# EAGLE schematic spi_lcd_onesided (EAGLE 6.1)
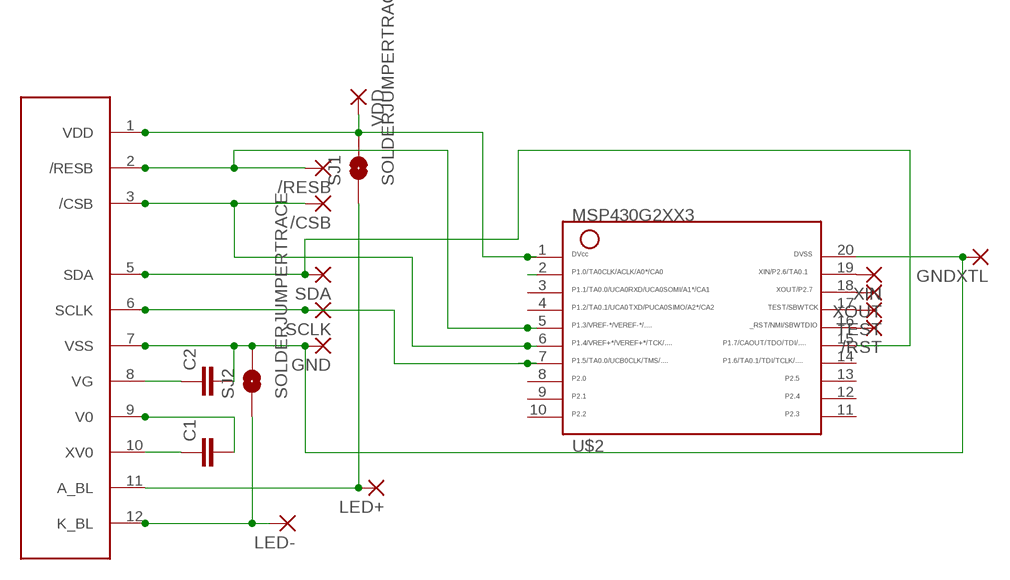
[diagram p0: schematic, sheet 1]

## Parts
/CSB  1,6/0,9  [1,6/0,9]
/RESB  1,6/0,9  [1,6/0,9]
/RST  1,6/0,9  [1,6/0,9]
C1  CAP0805  [0805]
C2  CAP0805  [0805]
GND  1,6/0,9  [1,6/0,9]
GNDXTL  SMD2  [SMD1,27-2,54]
LED+  1,6/0,9  [1,6/0,9]
LED-  1,6/0,9  [1,6/0,9]
SCLK  1,6/0,9  [1,6/0,9]
SDA  1,6/0,9  [1,6/0,9]
SJ1  SOLDERJUMPERTRACE  [SJ_2S-TRACE]
SJ2  SOLDERJUMPERTRACE  [SJ_2S-TRACE]
TEST  1,6/0,9  [1,6/0,9]
U$1  PE9665WRFPE9665WRF-WHOLE  [PE9665WRF]
U$2  G2XX3---PW20  [PW20]
VDD  1,6/0,9  [1,6/0,9]
XIN  SMD2  [SMD1,27-2,54]
XOUT  SMD2  [SMD1,27-2,54]

## Nets
C2: C2.1 U$1.8(VG)
GND: C2.2 GND.1(P) GNDXTL.1(P) SJ2.2 U$1.7(VSS) U$2.20
N$1: C1.1 U$1.10(XV0)
N$2: C1.2 U$1.9(V0)
N$3: U$2.19 XIN.1(P)
N$4: LED+.1(P) SJ1.1 U$1.11(A_BL)
N$5: LED-.1(P) SJ2.1 U$1.12(K_BL)
N$6: U$2.18 XOUT.1(P)
N$7: SCLK.1(P) U$1.6(SCLK) U$2.7
N$8: SDA.1(P) U$1.5(SDA) U$2.15
N$9: /CSB.1(P) U$1.3(/CSB) U$2.6
N$10: /RESB.1(P) U$1.2(/RESB) U$2.5
N$11: TEST.1(P) U$2.17
N$12: /RST.1(P) U$2.16
N$13: U$2.2
VDD: SJ1.2 U$1.1(VDD) U$2.1 VDD.1(P)
Unconnected: U$2.3 U$2.4 U$2.8 U$2.9 U$2.10 U$2.11 U$2.12 U$2.13 U$2.14

## Library data of the parts
/CSB /RESB /RST GND LED+ LED- SCLK SDA TEST VDD = wirepad:1,6/0,9: THROUGH-HOLE PAD
C1 C2 = SparkFun-Passives:CAP: Capacitor Standard 0603 ceramic capacitor, and 0.1" leaded capacitor.
GNDXTL XIN XOUT = wirepad:SMD2: SMD PAD
SJ1 SJ2 = SparkFun-Passives:SOLDERJUMPER: Solder Jumper Standard SMD solder jumper. Used to automate production. Two varients : Normally Open and Normally Closed are the same, but have different paste layers. NC will have a large amount of paste and should jumper during reflow.
U$1 = apus-spidisplay:PE9665WRF
U$2 = TI_MSP430_v16:G2XX3---PW20: MSP430G2XX1 TSSOP (PW) 20 Pin Package